# EasyEDA Pro project ProDoc_hapTGP_2025-10-23.epro

# Schematic hapTGP_SCH

## Sheets
1 P1: Board Name: Board1; Create Date: 2025-09-11; Page Name: P1; Project Name: HapTGP; Schematic Name: SCH-MB_RPI_ZERO_2W_1V1; Update Date: 2025-10-09; Company: Cégep André-Laurendeau; Page Size: A4; Version: V1.1
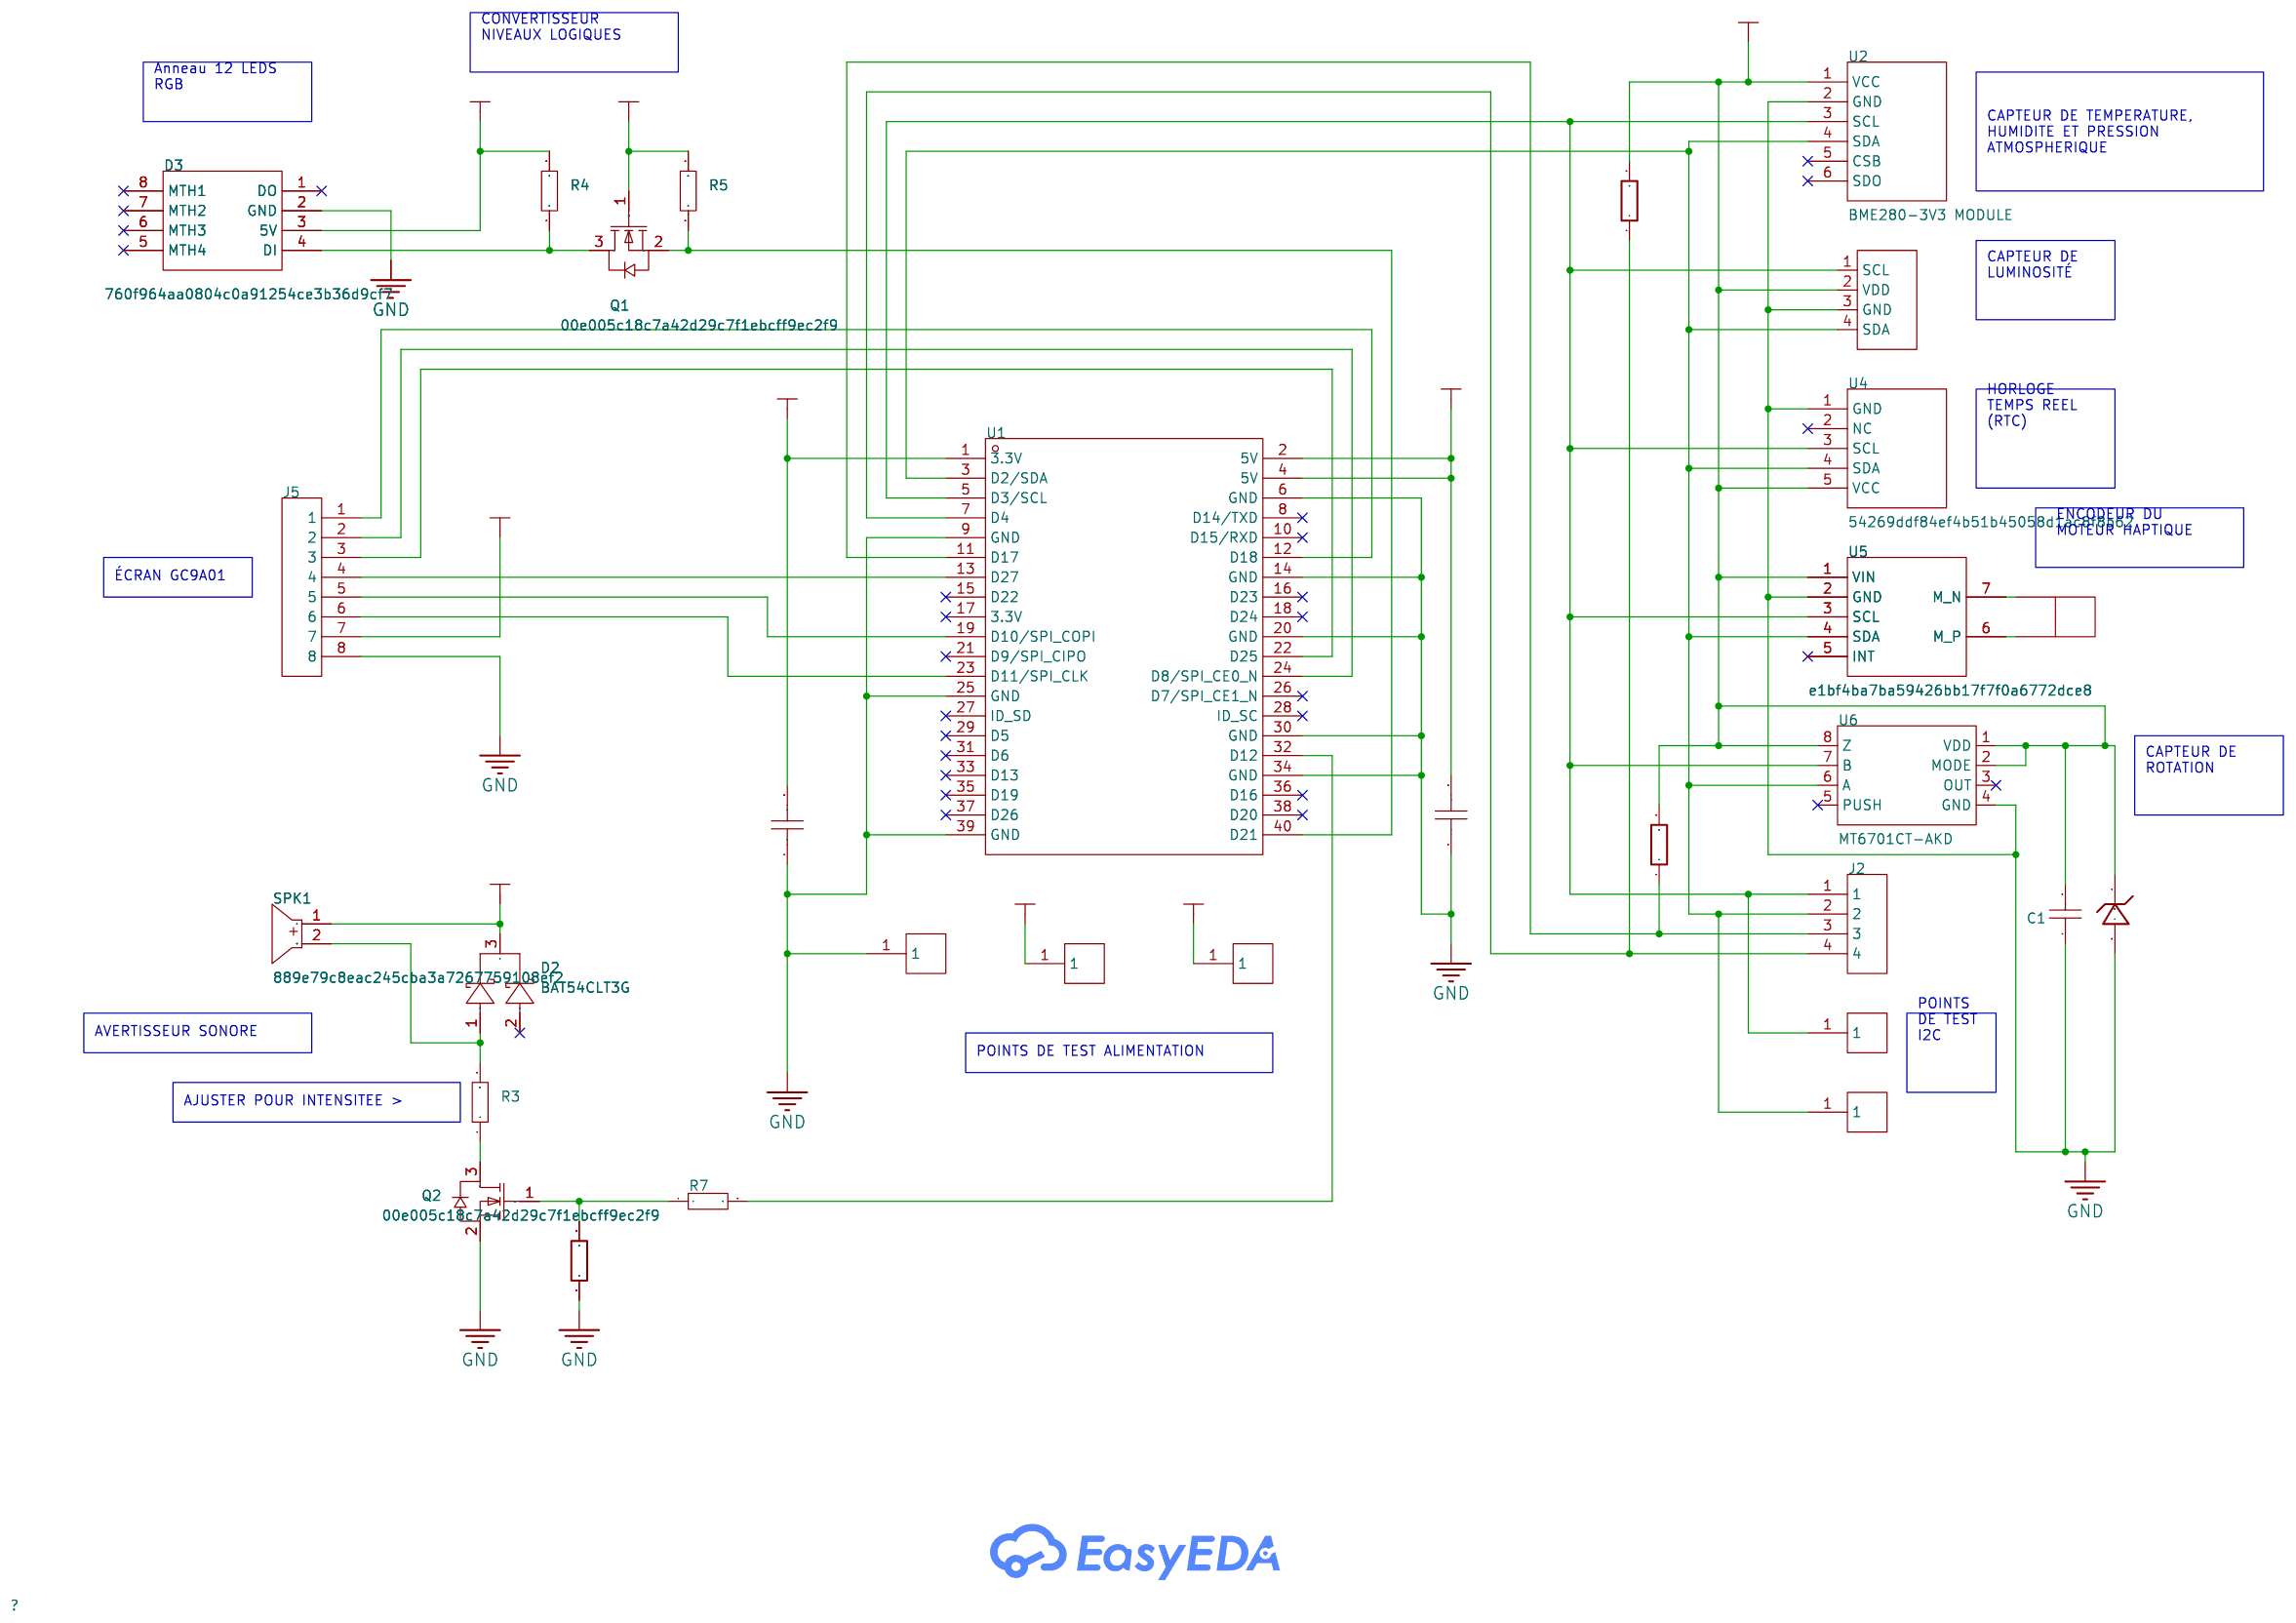
[diagram p0: P1]
2 P2: Create Date: 2025-10-02; Page Name: P2; Update Date: 2025-10-02; Company: EasyEDA.com; Version: V1.0
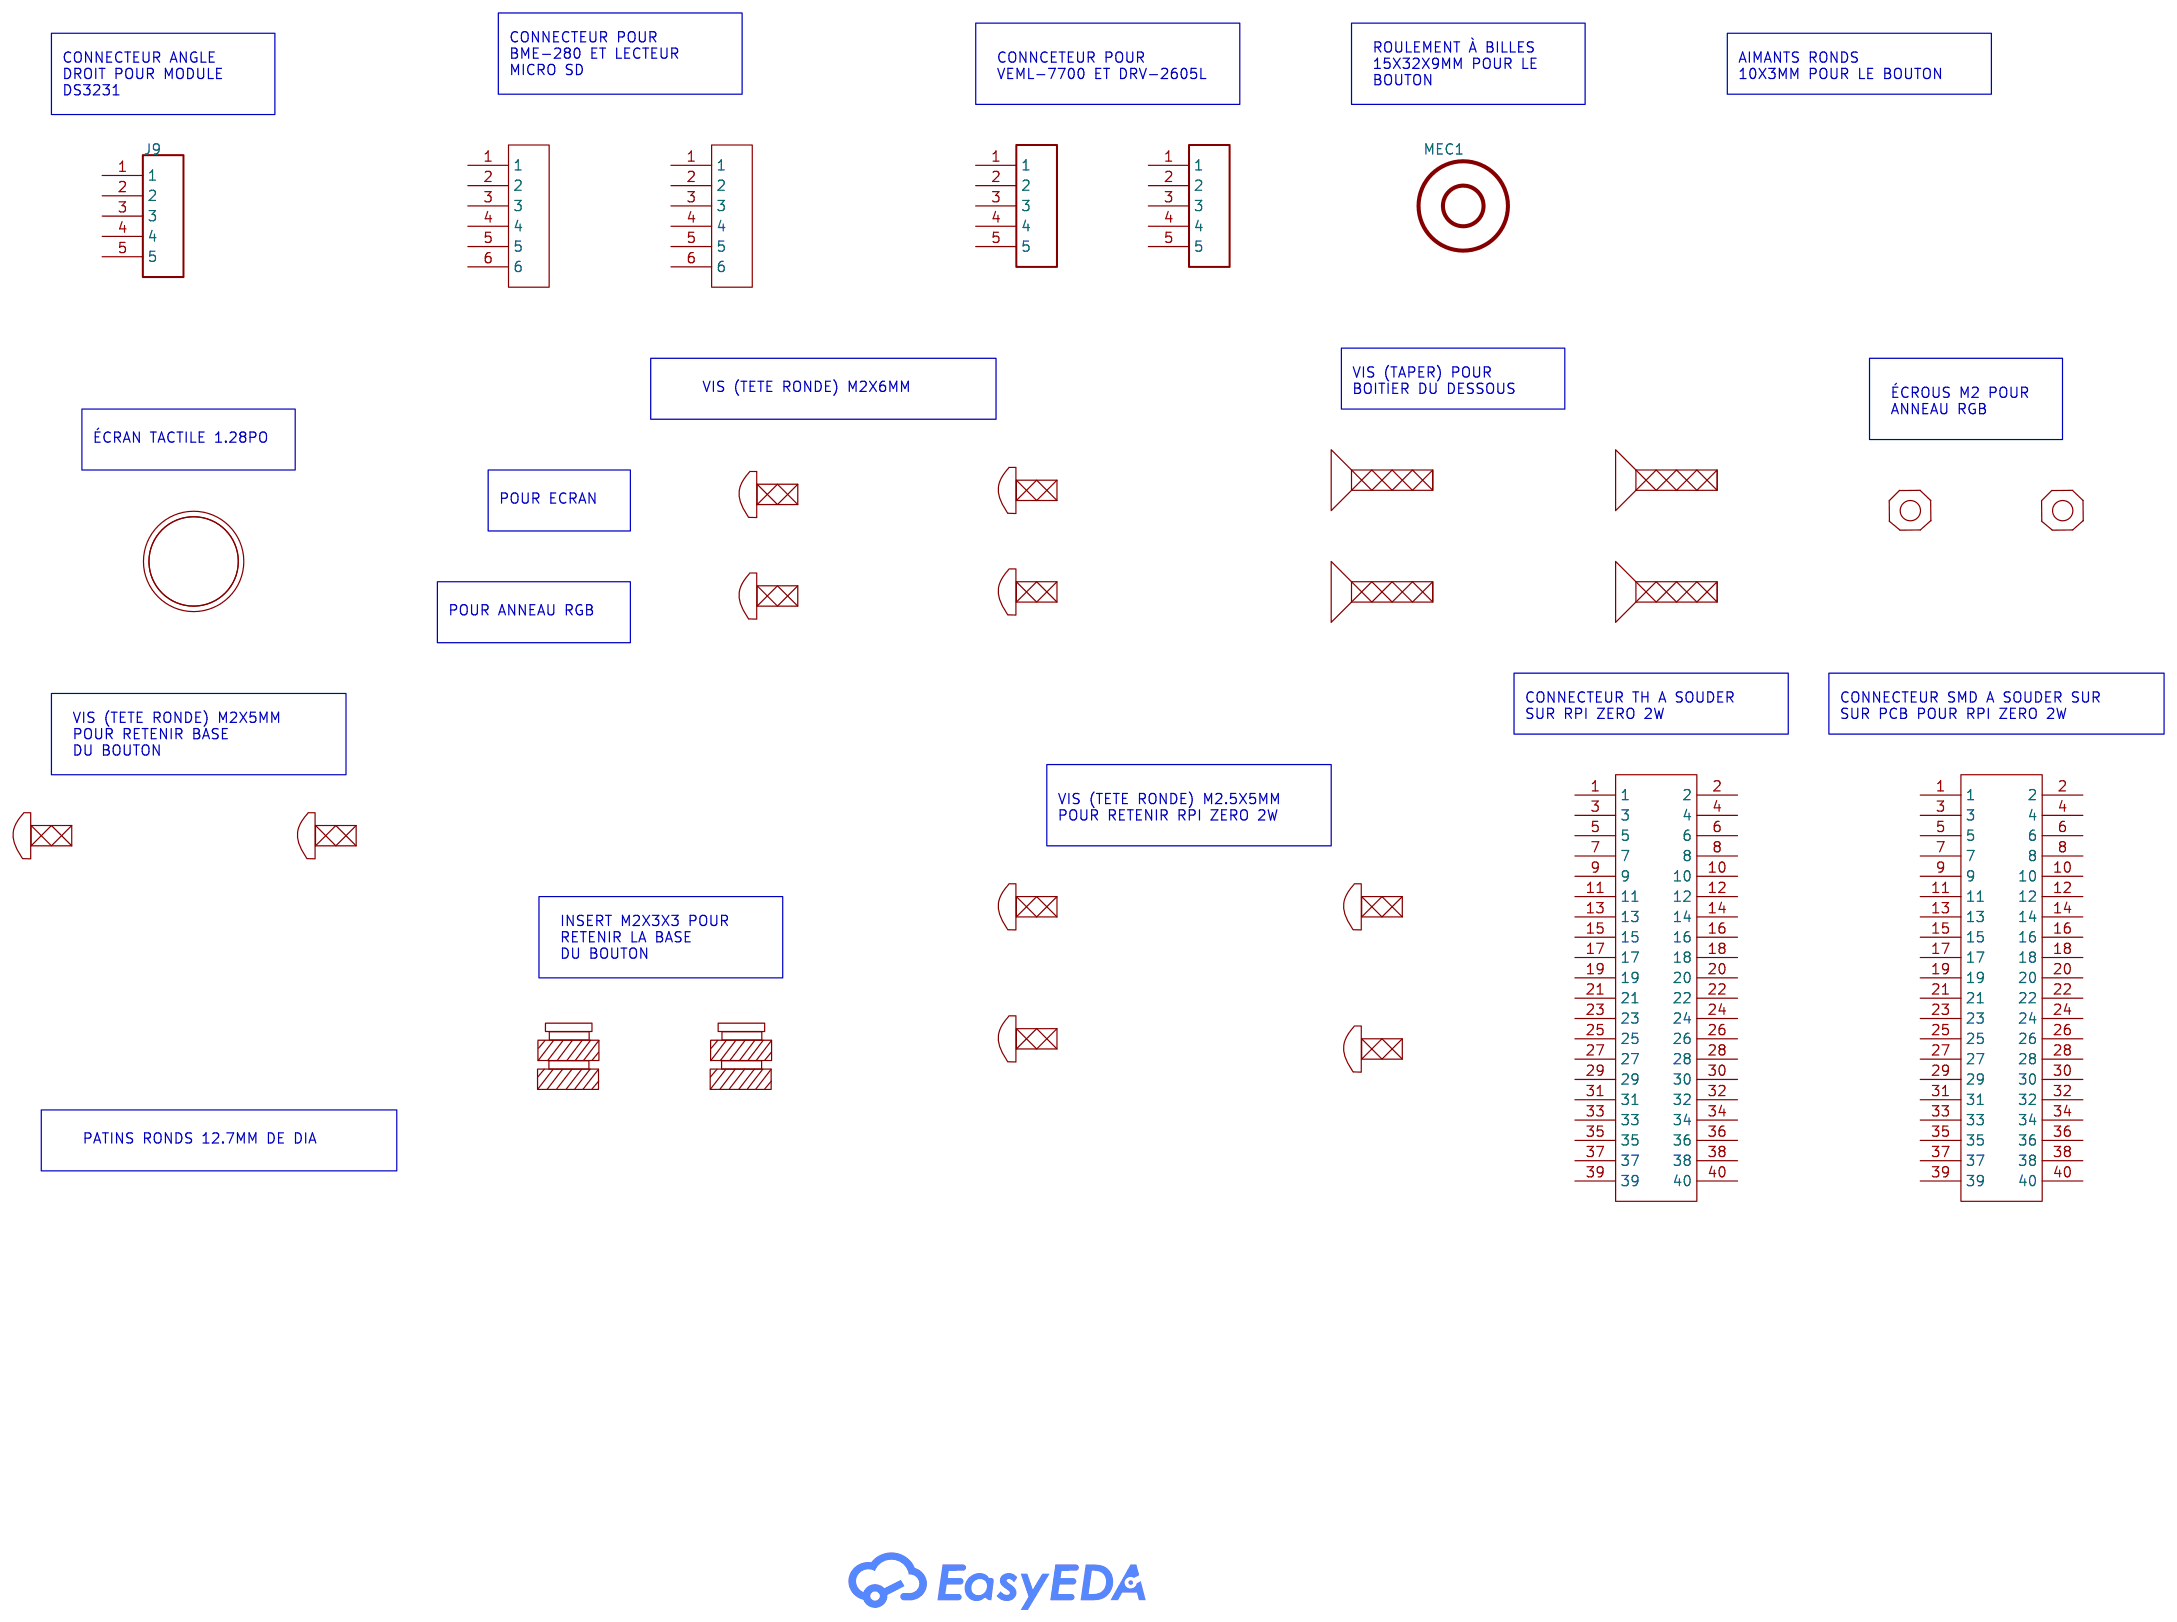
[diagram p1: P2]

## Parts
sheet P1
C1  0.1uF  [C1206]
C2  10µF  [C1206]
C3  10µF  [C1206]
D1  786c42ee781a49819dcb2175513ac30d  [SMA_L4.3-W2.6-LS5.2-RD]
D2  BAT54CLT3G  [SOT-23-3_L2.9-W1.3-P1.90-LS2.4-BR_LONG_PAD]
D3  760f964aa0804c0a91254ce3b36d9cf7  [12BIT_WS2812_RING]
J2  df3f6e4d750841a1978b57070b38a967  [TSW-104-07-G-S]
J3  25d9ce5fcc824b51a382671083746301  [TSW-101-07-G-S]
J4  25d9ce5fcc824b51a382671083746301  [TSW-101-07-G-S]
J5  db50c67101b641f09feebbd75da13b19  [TSW-108-07-G-S]
J6  25d9ce5fcc824b51a382671083746301  [TSW-101-07-G-S]
J7  25d9ce5fcc824b51a382671083746301  [TSW-101-07-G-S]
J8  25d9ce5fcc824b51a382671083746301  [TSW-101-07-G-S]
M1  a87b66f22e6449f7bc229c794d7d3cd7
Q1  00e005c18c7a42d29c7f1ebcff9ec2f9  [SOT-23-3_L2.9-W1.3-P1.90-LS2.4-BR_LONG_PAD]
Q2  00e005c18c7a42d29c7f1ebcff9ec2f9  [SOT-23-3_L2.9-W1.3-P1.90-LS2.4-BR_LONG_PAD]
R1  10kΩ  [R1206]
R3  100Ω  [R1206]
R4  1kΩ  [R1206]
R5  1kΩ  [R1206]
R6  10kΩ  [R1206]
R7  22.1Ω  [R1206]
R8  3.32kΩ  [R1206]
SPK1  2.048kHz  [CEM-1203(42)]
U1  82908ec7757f43da87b5bf82fbb97953  [RPI_ZERO_2W_SMD]
U2  BME280-3V3 MODULE  [BME280-3V3]
U4  54269ddf84ef4b51b45058d1ac8f8b62  [DS3231_FOR_PI]
U5  e1bf4ba7ba59426bb17f7f0a6772dce8  [DRV2605L_MODULE]
U6  MT6701CT-AKD  [SOIC-8_MT6701_LONG_PAD]
U7  e600161ae6e94e2281b32d82396dab58  [VEML7700-TT]
sheet P2
J9  d4bc78de218c43d6890ff5c2e1751f38  [TSW-105-08-G-S-RA]
J10  842bb1afb25c4c82b2ce2c1a00fc9b49  [TSW-106-07-G-S]
J11  842bb1afb25c4c82b2ce2c1a00fc9b49  [TSW-106-07-G-S]
J12  519a3672ea174b5fbedaf20516a41a10  [TSW-105-07-G-S]
J13  519a3672ea174b5fbedaf20516a41a10  [TSW-105-07-G-S]
J14  320c196bd822489ebe2c8557b4e2ea87  [TSW-120-07-G-D]
J15  60a980731c99412ab857ed917eeb6bae  [SSM-120-L-DV]
MEC1  4874c76d77fe4fedaef2837b43ac3319
MEC2  a5e0b033ab874c949acdb6fa7986dbbc
MEC3  a5e0b033ab874c949acdb6fa7986dbbc
MEC4  55b254a44b8a4a90b11fe05f35b53fb9
MEC5  84bc130494194e13a6b8797a8c02c4b9
MEC6  84bc130494194e13a6b8797a8c02c4b9
MEC7  84bc130494194e13a6b8797a8c02c4b9
MEC8  84bc130494194e13a6b8797a8c02c4b9
MEC9  e747b9e705f54f58a9aa79ca04ba0c74
MEC10  e747b9e705f54f58a9aa79ca04ba0c74
MEC11  e747b9e705f54f58a9aa79ca04ba0c74
MEC12  e747b9e705f54f58a9aa79ca04ba0c74
MEC13  0744fd2aaf9640809141f7db8254e100
MEC14  0744fd2aaf9640809141f7db8254e100
MEC15  44b7d81d582e44f3a2eef445dd88f108
MEC16  44b7d81d582e44f3a2eef445dd88f108
MEC17  44b7d81d582e44f3a2eef445dd88f108
MEC18  44b7d81d582e44f3a2eef445dd88f108
MEC19  fea318fc1c2846968e82746a332974ab
MEC20  fea318fc1c2846968e82746a332974ab
MEC21  b4d0d6735a904df985b20de909715984
MEC22  b4d0d6735a904df985b20de909715984
MEC23  3b06449f621e43b7b0359324f8e45c47
MEC24  3b06449f621e43b7b0359324f8e45c47
MEC25  3b06449f621e43b7b0359324f8e45c47
MEC26  3b06449f621e43b7b0359324f8e45c47

## Library data of the parts
C1 = C1206C104M5RAC7800: 0.1 µF ±20% 50V Ceramic Capacitor X7R 1206 (3216 Metric); Supplier: Digikey; Manufacturer: KEMET; Supplier Part: 399-C1206C104M5RACTUCT-ND; URL: https://www.digikey.ca/en/products/detail/kemet/C1206C104M5RAC7800/411247
C2 C3 = CL31B106MOHNNNE: 10 µF ±20% 16V Ceramic Capacitor X7R 1206 (3216 Metric); Supplier Part: 1276-6641-1-ND; Manufacturer: Samsung Electro-Mechanics; Supplier: Digikey; URL: https://www.digikey.ca/en/products/detail/samsung-electro-mechanics/CL31B106MOHNNNE/5961125?s=N4IgTCBcDaIMIBkDMBGAQigDANgLIHkAJAOVIFEQBdAXyA
D1 = SMAJ6.0A: 10.3V Clamp 38.8A Ipp Tvs Diode Surface Mount DO-214AC (SMA); Supplier: Digikey; Manufacturer: Littelfuse Inc.; Supplier Part: SMAJ6.0ALFCT-ND; URL: https://www.digikey.ca/en/products/detail/littelfuse-inc/SMAJ6-0A/762252
D2 = BAT54C/SOT23: Diode Array 1 Pair Common Cathode 30 V 200mA (DC) Surface Mount TO-236-3, SC-59, SOT-23-3; Supplier Part: BAT54CLT3GOSCT-ND; Manufacturer: onsemi; Supplier: Digikey; URL: https://www.digikey.ca/en/products/detail/onsemi/BAT54CLT3G/1792157?s=N4IgTCBcDaIEIEEAqBWALAYQDJIMwHEB5AZQyQFoA5AERAF0BfIA
D3 = 12BIT_WS2812_RING: 12 Bit WS2812 Neopixel Ring; Manufacturer: WAVGAT Official Store; Manufacturer Part: Color: 12 Bit; Supplier: Aliexpress; Supplier Part: Color: 12 Bit; URL: https://www.aliexpress.com/item/32758176722.html?spm=a2g0o.order_list.order_list_main.9.3dfb1802yhWrDt
J2 = TSW-104-07-G-S: Connector Header Through Hole 4 position 0.100" (2.54mm); Manufacturer: Samtec; Supplier: Digikey; Supplier Part: SAM1029-04-ND; URL: https://www.digikey.ca/en/products/detail/samtec-inc/TSW-104-07-G-S/1101323
J3 J4 J6-J8 = TSW-101-07-G-S: Connector Header Through Hole 1 position; Manufacturer: Samtec; Supplier: Digikey; Supplier Part: SAM1029-01-ND; URL: https://www.digikey.ca/en/products/detail/samtec-inc/TSW-101-07-G-S/1101326
J5 = TSW-108-07-G-S: Connector Header Through Hole 8 position 0.100" (2.54mm); Manufacturer: Samtec; Supplier: Digikey; Supplier Part: SAM1029-08-ND; URL: https://www.digikey.ca/en/products/detail/samtec-inc/TSW-108-07-G-S/1101319
M1 = HAPTIC_MOTOR_10X2MM: DC Motor Vibration, ERM (Haptic) 3VDC; URL: https://www.digikey.ca/en/products/detail/seeed-technology-co-ltd/316040001/5487672?s=N4IgTCBcDaIIwFYCcB2AtHMAWLaByAIiALoC%2BQA; Manufacturer: Seeed Technology Co., Ltd; Manufacturer Part: 316040001; Supplier: Digikey; Supplier Part: 1597-1244-ND
Q1 Q2 = BSS138: N-Channel 50 V 170mA 350mW (Ta) Surface Mount SOT-23-3; Supplier: Digikey; Manufacturer: OnSemi; Supplier Part: BSS138CT-ND; URL: https://www.digikey.ca/en/products/detail/onsemi/BSS138/244210
R1 R6 = RMCF1206FT10K0: 10 kOhms ±1% 0.25W, 1/4W Chip Resistor 1206 (3216 Metric) Automotive AEC-Q200 Thick Film; Supplier: Digikey; Supplier Part: RMCF1206FT10K0CT-ND; Manufacturer: Stackpole Electronics Inc; URL: https://www.digikey.ca/en/products/detail/stackpole-electronics-inc/RMCF1206FT10K0/1759669?s=N4IgTCBcDaIEoFkDCAxAjGADANhQFTUwGlMQBdAXyA
R3 = RMCF1206FG100R: 100 Ohms ±1% 0.25W, 1/4W Chip Resistor 1206 (3216 Metric) Automotive AEC-Q200 Thick Film; Supplier: Digikey; Supplier Part: RMCF1206FG100RCT-ND; Manufacturer: Stackpole Electronics Inc; URL: https://www.digikey.ca/en/products/detail/stackpole-electronics-inc/RMCF1206FG100R/1759135?s=N4IgTCBcDaIEoFkDCAxAjGADANhQcTU0zhAF0BfIA
R4 R5 = RNCP1206FTD1K00: 1 kOhms ±1% 0.5W, 1/2W Chip Resistor 1206 (3216 Metric) Anti-Sulfur Thin Film; Supplier: Digikey; Supplier Part: RNCP1206FTD1K00CT-ND; Manufacturer: Stackpole Electronics Inc; URL: https://www.digikey.ca/en/products/detail/stackpole-electronics-inc/RNCP1206FTD1K00/2240337
R7 = RNCP1206FTD22R1: 22.1 Ohms ±1% 0.5W, 1/2W Chip Resistor 1206 (3216 Metric) Anti-Sulfur Thin Film; Supplier: Digikey; Supplier Part: RNCP1206FTD22R1CT-ND; Manufacturer: Stackpole Electronics Inc; URL: https://www.digikey.ca/en/products/detail/stackpole-electronics-inc/RNCP1206FTD22R1/2240307
R8 = RMCF1206FT3K32: 3.32 kOhms ±1% 0.25W, 1/4W Chip Resistor 1206 (3216 Metric) Automotive AEC-Q200 Thick Film; Supplier: Digikey; Manufacturer: Stackpole Electronics Inc; URL: https://www.digikey.ca/en/products/detail/stackpole-electronics-inc/RMCF1206FT3K32/1753915
SPK1 = CEM-1203(42): Driver Circuitry:Passive (external drive) Technology:Electromagnetic Type Voltage - Supply:3V~5V Voltage - Supply:3V~5V Frequency:2.048kHz Sound Pressure Level(SPL):85dB Diameter(φD):12mm Height:9mm Operating Temperature:-20℃~+60℃ Operating Temperature:-2; Supplier Part: 102-1153-ND; Manufacturer: CUI; Supplier: Digikey; URL: https://www.digikey.ca/en/products/detail/same-sky-formerly-cui-devices/CEM-1203-42/412412
U1 = RPI_ZERO_2W_SMD: Raspberry Pi Zero 2 W SC1176 single board computer.,1GHz quad-core Broadcom BCM2710A1 Arm Cortex-A53 processor, 512MB of RAM, 40 digital I/O lines, Bluetooth 4.2, BLE, HAT GPIO and LAN.; Supplier Part: 2648-SC1176-ND; Manufacturer: Raspberry Pi; Manufacturer Part: SC1176; Supplier: Digikey; URL: https://www.digikey.ca/en/products/detail/raspberry-pi/SC1176/15298147
U2 = BME280-3V3 MODULE: Humidity, Pressure, Temperature 0 ~ 100% RH I2C, SPI ±3% 1 s Surface Mount; Manufacturer: Simple Robot Store; Manufacturer Part: GY-BME280-3.3V; Supplier Part: GY-BME280-3.3V; Supplier: Aliexpress; URL: https://www.aliexpress.com/item/1005002963592665.html?spm=a2g0o.order_list.order_list_main.4.32a61802cuksvp
U4 = DS3231_FOR_PI: Real Time Clock (RTC) IC Clock/Calendar I2C, 2-Wire Serial; Supplier Part: DS3231; Supplier: Aliexpress; Manufacturer: Simple Robot Store; Manufacturer Part: DS3231; URL: https://www.aliexpress.com/item/1812869576.html?spm=a2g0o.order_list.order_list_main.152.32a61802cuksvp
U5 = DRV2605L_MODULE: Adafruit DRV2605L Haptic Motor Controller; Manufacturer: Simple Robot Store; Manufacturer Part: Color: Driving module; Supplier: Aliexpress; URL: https://www.aliexpress.com/item/1005006900947978.html?spm=a2g0o.order_list.order_list_main.14.679a1802Tgud2h; Supplier Part: Color: Driving module
U6 = MT6701CT-AKD: Hall Based Angle Position Encoder Sensor; Supplier: Aliexpress; Supplier Part: SOP8-IIC Default; Manufacturer: Red Yellow Store; Manufacturer Part: SOP8-IIC Default; URL: https://www.aliexpress.com/item/1005008024064935.html?spm=a2g0o.order_list.order_list_main.4.3da51802w8S4od
U7 = VEML7700-TT: Optical Sensor Ambient I2C 4-SMD, J-Lead - Top View; Supplier Part: 751-VEML7700-TTCT-ND; Manufacturer: Vishay; Supplier: Digikey; URL: https://www.digikey.ca/en/products/detail/vishay-semiconductor-opto-division/VEML7700-TT/6210690
J9 = TSW-105-08-G-S-RA: Connector Header Through Hole, Right Angle 5 position 0.100" (2.54mm); Manufacturer: Samtec; Supplier: Digikey; Supplier Part: SAM1039-05-ND; URL: https://www.digikey.ca/en/products/detail/samtec-inc/TSW-105-08-G-S-RA/1101819
J10 J11 = TSW-106-07-G-S: Connector Header Through Hole 6 position 0.100" (2.54mm); Manufacturer: Samtec; Supplier: Digikey; Supplier Part: SAM1029-06-ND; URL: https://www.digikey.ca/en/products/detail/samtec-inc/TSW-106-07-G-S/1101321
J12 J13 = TSW-105-07-G-S: Connector Header Through Hole 5 position 0.100" (2.54mm); Manufacturer: Samtec; Supplier: Digikey; Supplier Part: SAM1029-05-ND; URL: https://www.digikey.ca/en/products/detail/samtec-inc/TSW-105-07-G-S/1101322
J14 = TSW-120-07-G-D: Connector Header Through Hole 40 position 0.100" (2.54mm); URL: https://www.digikey.ca/en/products/detail/samtec-inc/TSW-120-07-G-D/1101257; Manufacturer: Samtec; Supplier: Digikey; Supplier Part: SAM1028-20-ND
J15 = SSM-120-L-DV: 40 Position Receptacle, Pass Through Connector 0.100" (2.54mm) Surface Mount Gold; URL: https://www.digikey.ca/en/products/detail/samtec-inc/SSM-120-L-DV/1106211; Manufacturer: Samtec; Supplier: Digikey; Supplier Part: SAM1146-20-ND
MEC1 = BEARING_15x32x9MM: 6002-2RS 15x32x9mm Precision Chrome Steel Bearings Double Rubber Sealed Seal Bearings 10Pcs for RC Car / UAV / Bicycles; URL: https://aliexpi.com/Iuda; Supplier: Aliexpress; Manufacturer: Bearing World Store; Manufacturer Part: 6002-2RS; Supplier Part: 6002-2RS
MEC2 MEC3 = MAGNET_10X3MM_ROUND: 10x3mm tiny round disc small, refrigerator neodymium 20/50/100pcs, Muti-use premium neodymium fridge rare earth, whiteboard; URL: https://aliexpi.com/sLDT; Manufacturer: Magical Magnet Life Store; Manufacturer Part: Color: 10x3mm-10PCS; Supplier: Aliexpress; Supplier Part: Color: 10x3mm-10PCS
MEC4 = 1.28IN_TFT_TOUCH_SCREEN: 1.28 inch TFT Screen Display Module 1.28" IPS Round Colorful LCD Board GC9A01 Touch 240x240 SPI; URL: https://aliexpi.com/IKIM; Manufacturer: Your Cee; Manufacturer Part: Color: Module With Touch; Supplier: Aliexpress; Supplier Part: Color: Module With Touch
MEC5-MEC8 = M2x6_ROUND_HEAD_SCREW: M2 Stainless steel iron plating round head, Phillips screw bolt length 6mm; URL: https://aliexpi.com/RNjy; Manufacturer: Darzoom Store; Manufacturer Part: Size: M2, Length: 6mm; Supplier: Aliexpress; Supplier Part: Size: M2, Length: 6mm
MEC9-MEC12 = M3x20_FLAT_HEAD_SCREW: M3x20mm Flat Head Machine Screws; URL: https://www.amazon.ca/dp/B07VK3Y6WK?ref=ppx_yo2ov_dt_b_fed_asin_title&th=1; Supplier: Amazon.ca; Supplier Part: M3x20mm; Manufacturer: UXCELL; Manufacturer Part: M3x20mm
MEC13 MEC14 = M2x5_ROUND_HEAD_SCREW: M2 Stainless steel iron plating round head, Phillips screw bolt length 5mm; URL: https://aliexpi.com/Fjtn; Manufacturer: Darzoom Store; Manufacturer Part: Size: M2, Length: 5mm; Supplier: Aliexpress; Supplier Part: Size: M2, Length: 5mm
MEC15-MEC18 = M2.5x5_ROUND_HEAD_SCREW: M2.5 Stainless steel iron plating round head, Phillips screw bolt length 5mm; URL: https://aliexpi.com/Fjtn; Manufacturer: Darzoom Store; Manufacturer Part: Size: M2.5, Length: 5mm; Supplier: Aliexpress; Supplier Part: Size: M2.5, Length: 5mm
MEC19 MEC20 = M2_HEX_NUT: Stainless steel iron Hex Hexagon Nut for M2 Srew Bolt; URL: https://aliexpi.com/RLok; Manufacturer: Darzoom Store; Manufacturer Part: Size: M2 ( 50 pcs); Supplier: Aliexpress; Supplier Part: Size: M2 ( 50 pcs)
MEC21 MEC22 = INSERT_M2X3X3: M2 Heat Set Insert for 3D Printing Components and Plastic Parts - Brass Metric Knurled Nuts; URL: https://www.amazon.ca/-/fr/HANGLIFE-thermodurcissables-composants-dimpression-plastique/dp/B0CS6XJSSL/?th=1; Manufacturer: Hanglife; Manufacturer Part: Colour Name: M2 X D3 X L3(100pcs); Supplier: Amazon; Supplier Part: Colour Name: M2 X D3 X L3(100pcs)
MEC23-MEC26 = ClearRubberBumper_12.7MM: Round 12.7mm Cabinet Bumpers Soft Self-Adhesive Clear Rubber Bumper; Manufacturer: Furnigear; Manufacturer Part: Size: Cylindrical 96pcs; Supplier: Amazon.ca; Supplier Part: Size: Cylindrical 96pcs; URL: https://www.amazon.ca/dp/B0BZBXY984?ref=ppx_yo2ov_dt_b_product_details&th=1

## Nets
3V3: C1.2 C3.2 D1.1(C) D2.3(K) J5.7 J8.1 Q1.1(G) R1.2 R5.2 R8.2 SPK1.1 U1.1(3.3V) U2.1(VCC) U4.5(VCC) U5.1(VIN) U6.1(VDD) U6.2(MODE) U6.8(Z) U7.2(VDD)
5V0: C2.2 D3.3(5V) J7.1 R4.2 U1.2(5V) U1.4(5V)
GND: C1.1 C2.1 C3.1 D1.2(A) D3.2(GND) J5.8 J6.1 Q2.2(S) R6.1 U1.6(GND) U1.9(GND) U1.14(GND) U1.20(GND) U1.25(GND) U1.30(GND) U1.34(GND) U1.39(GND) U2.2(GND) U4.1(GND) U5.2(GND) U6.4(GND) U7.3(GND)
$1N1876: J2.4 R1.1 U1.7(D4)
$1N2735: J2.2 J4.1 U1.3(D2/SDA) U2.4(SDA) U4.4(SDA) U5.4(SDA) U6.6(A) U7.4(SDA)
$1N2755: J2.1 J3.1 U1.5(D3/SCL) U2.3(SCL) U4.3(SCL) U5.3(SCL) U6.7(B) U7.1(SCL)
$1N3138: J5.4 U1.13(D27)
$1N3152: J5.5 U1.19(D10/SPI_COPI)
$1N3158: J5.6 U1.23(D11/SPI_CLK)
$1N3184: J5.1 U1.12(D18)
$1N3198: J5.2 U1.24(D8/SPI_CE0_N)
$1N3220: J5.3 U1.22(D25)
$1N3578: D2.1(A) R3.2 SPK1.2
$1N4140: Q1.2(S) R5.1 U1.40(D21)
$1N4146: D3.4(DI) Q1.3(D) R4.1
$1N4451: Q2.3(D) R3.1
$1N4603: R7.2 U1.32(D12)
$1N4609: Q2.1(G) R6.2 R7.1
$1N5451: J2.3 R8.1 U1.11(D17)

Not connected (* = marked no-connect by the designer): D2 2(A)*; D3 1(DO)* 5(MTH4)* 6(MTH3)* 7(MTH2)* 8(MTH1)*; J9 1 2 3 4 5; J10 1 2 3 4 5 6; J11 1 2 3 4 5 6; J12 1 2 3 4 5; J13 1 2 3 4 5; J14 1 2 3 4 5 6 7 8 9 10 11 12 13 14 15 16 17 18 19 20 21 22 23 24 25 26 27 28 29 30 31 32 33 34 35 36 37 38 39 40; J15 1 2 3 4 5 6 7 8 9 10 11 12 13 14 15 16 17 18 19 20 21 22 23 24 25 26 27 28 29 30 31 32 33 34 35 36 37 38 39 40; U1 8(D14/TXD)* 10(D15/RXD)* 15(D22)* 16(D23)* 17(3.3V)* 18(D24)* 21(D9/SPI_CIPO)* 26(D7/SPI_CE1_N)* 27(ID_SD)* 28(ID_SC)* 29(D5)* 31(D6)* 33(D13)* 35(D19)* 36(D16)* 37(D26)* 38(D20)*; U2 5(CSB)* 6(SDO)*; U4 2(NC)*; U5 5(INT)* 6(M_P) 7(M_N); U6 3(OUT)* 5(PUSH)*

## Notes on the sheets
sheet 1
- CONVERTISSEUR
  NIVEAUX LOGIQUES
- Anneau 12 LEDS
  RGB
- CAPTEUR DE TEMPERATURE,
  HUMIDITE ET PRESSION
  ATMOSPHERIQUE
- CAPTEUR DE
  LUMINOSITÉ
- HORLOGE
  TEMPS REEL
  (RTC)
- ENCODEUR DU
  MOTEUR HAPTIQUE
- ÉCRAN GC9A01
- CAPTEUR DE
  ROTATION
- AVERTISSEUR SONORE
- POINTS DE TEST ALIMENTATION
- POINTS
  DE TEST
  I2C
- AJUSTER POUR INTENSITEE ­­>
sheet 2
- CONNECTEUR POUR
  BME-280 ET LECTEUR
  MICRO SD
- ROULEMENT À BILLES
  15X32X9MM POUR LE
  BOUTON
- CONNECTEUR ANGLE
  DROIT POUR MODULE
  DS3231
- CONNCETEUR POUR
  VEML-7700 ET DRV-2605L
- AIMANTS RONDS
  10X3MM POUR LE BOUTON
- VIS (TAPER) POUR
  BOITIER DU DESSOUS
- VIS (TETE RONDE) M2X6MM
- ÉCROUS M2 POUR
  ANNEAU RGB
- ÉCRAN TACTILE 1.28PO
- POUR ECRAN
- POUR ANNEAU RGB
- CONNECTEUR TH A SOUDER
  SUR RPI ZERO 2W
- CONNECTEUR SMD A SOUDER SUR
  SUR PCB POUR RPI ZERO 2W
- VIS (TETE RONDE) M2X5MM
  POUR RETENIR BASE
  DU BOUTON
- VIS (TETE RONDE) M2.5X5MM
  POUR RETENIR RPI ZERO 2W
- INSERT M2X3X3 POUR
  RETENIR LA BASE
  DU BOUTON
- PATINS RONDS 12.7MM DE DIA

# Board hapTGP_PCB
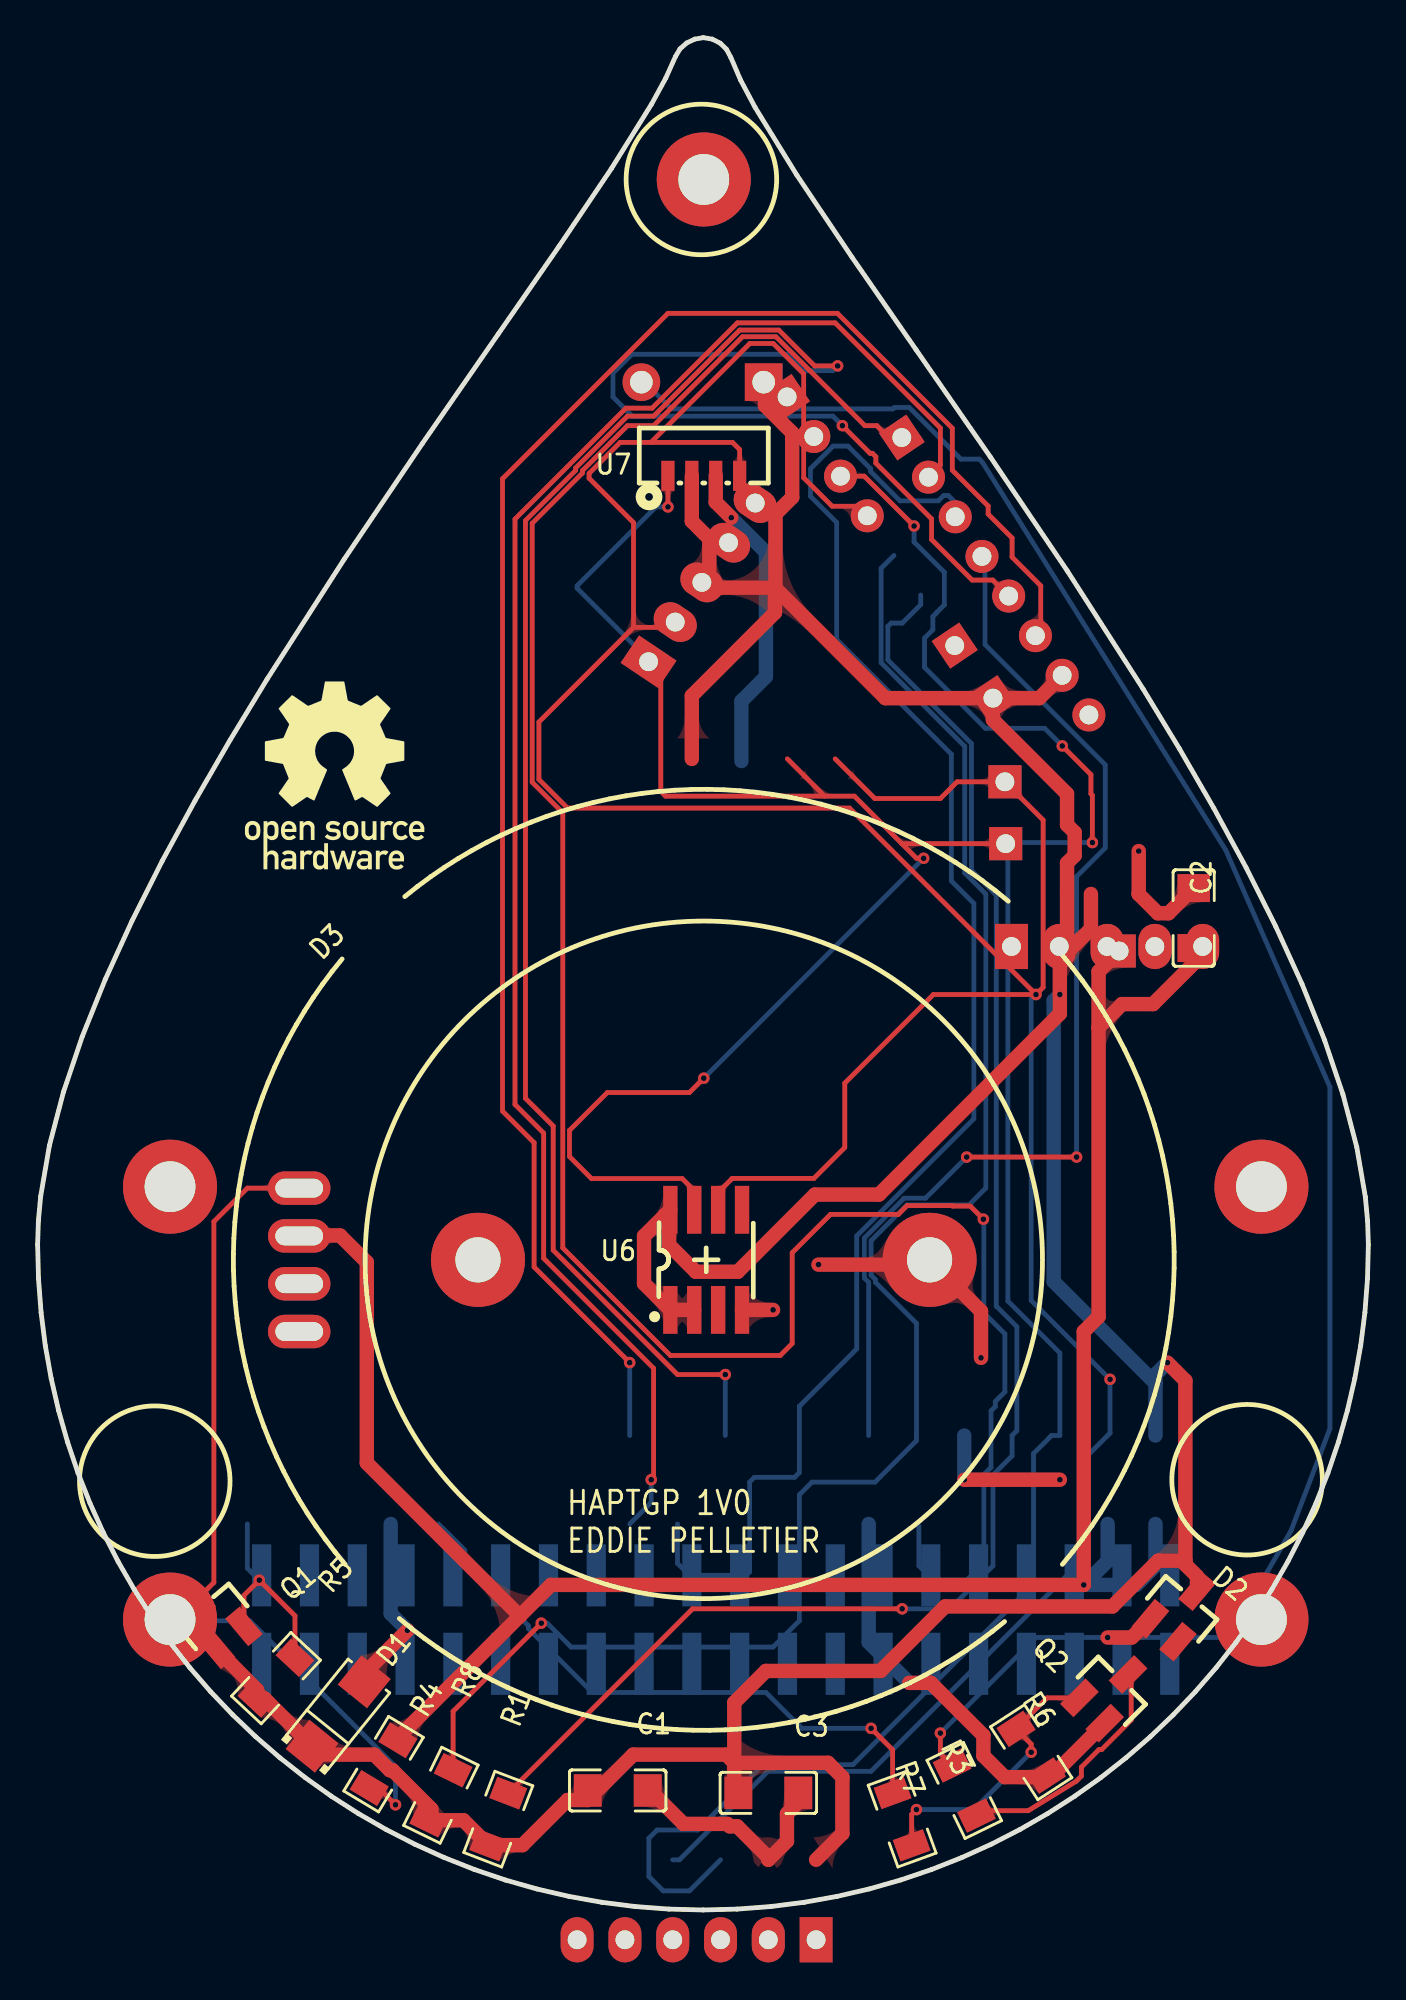
[diagram p2: board, top side]
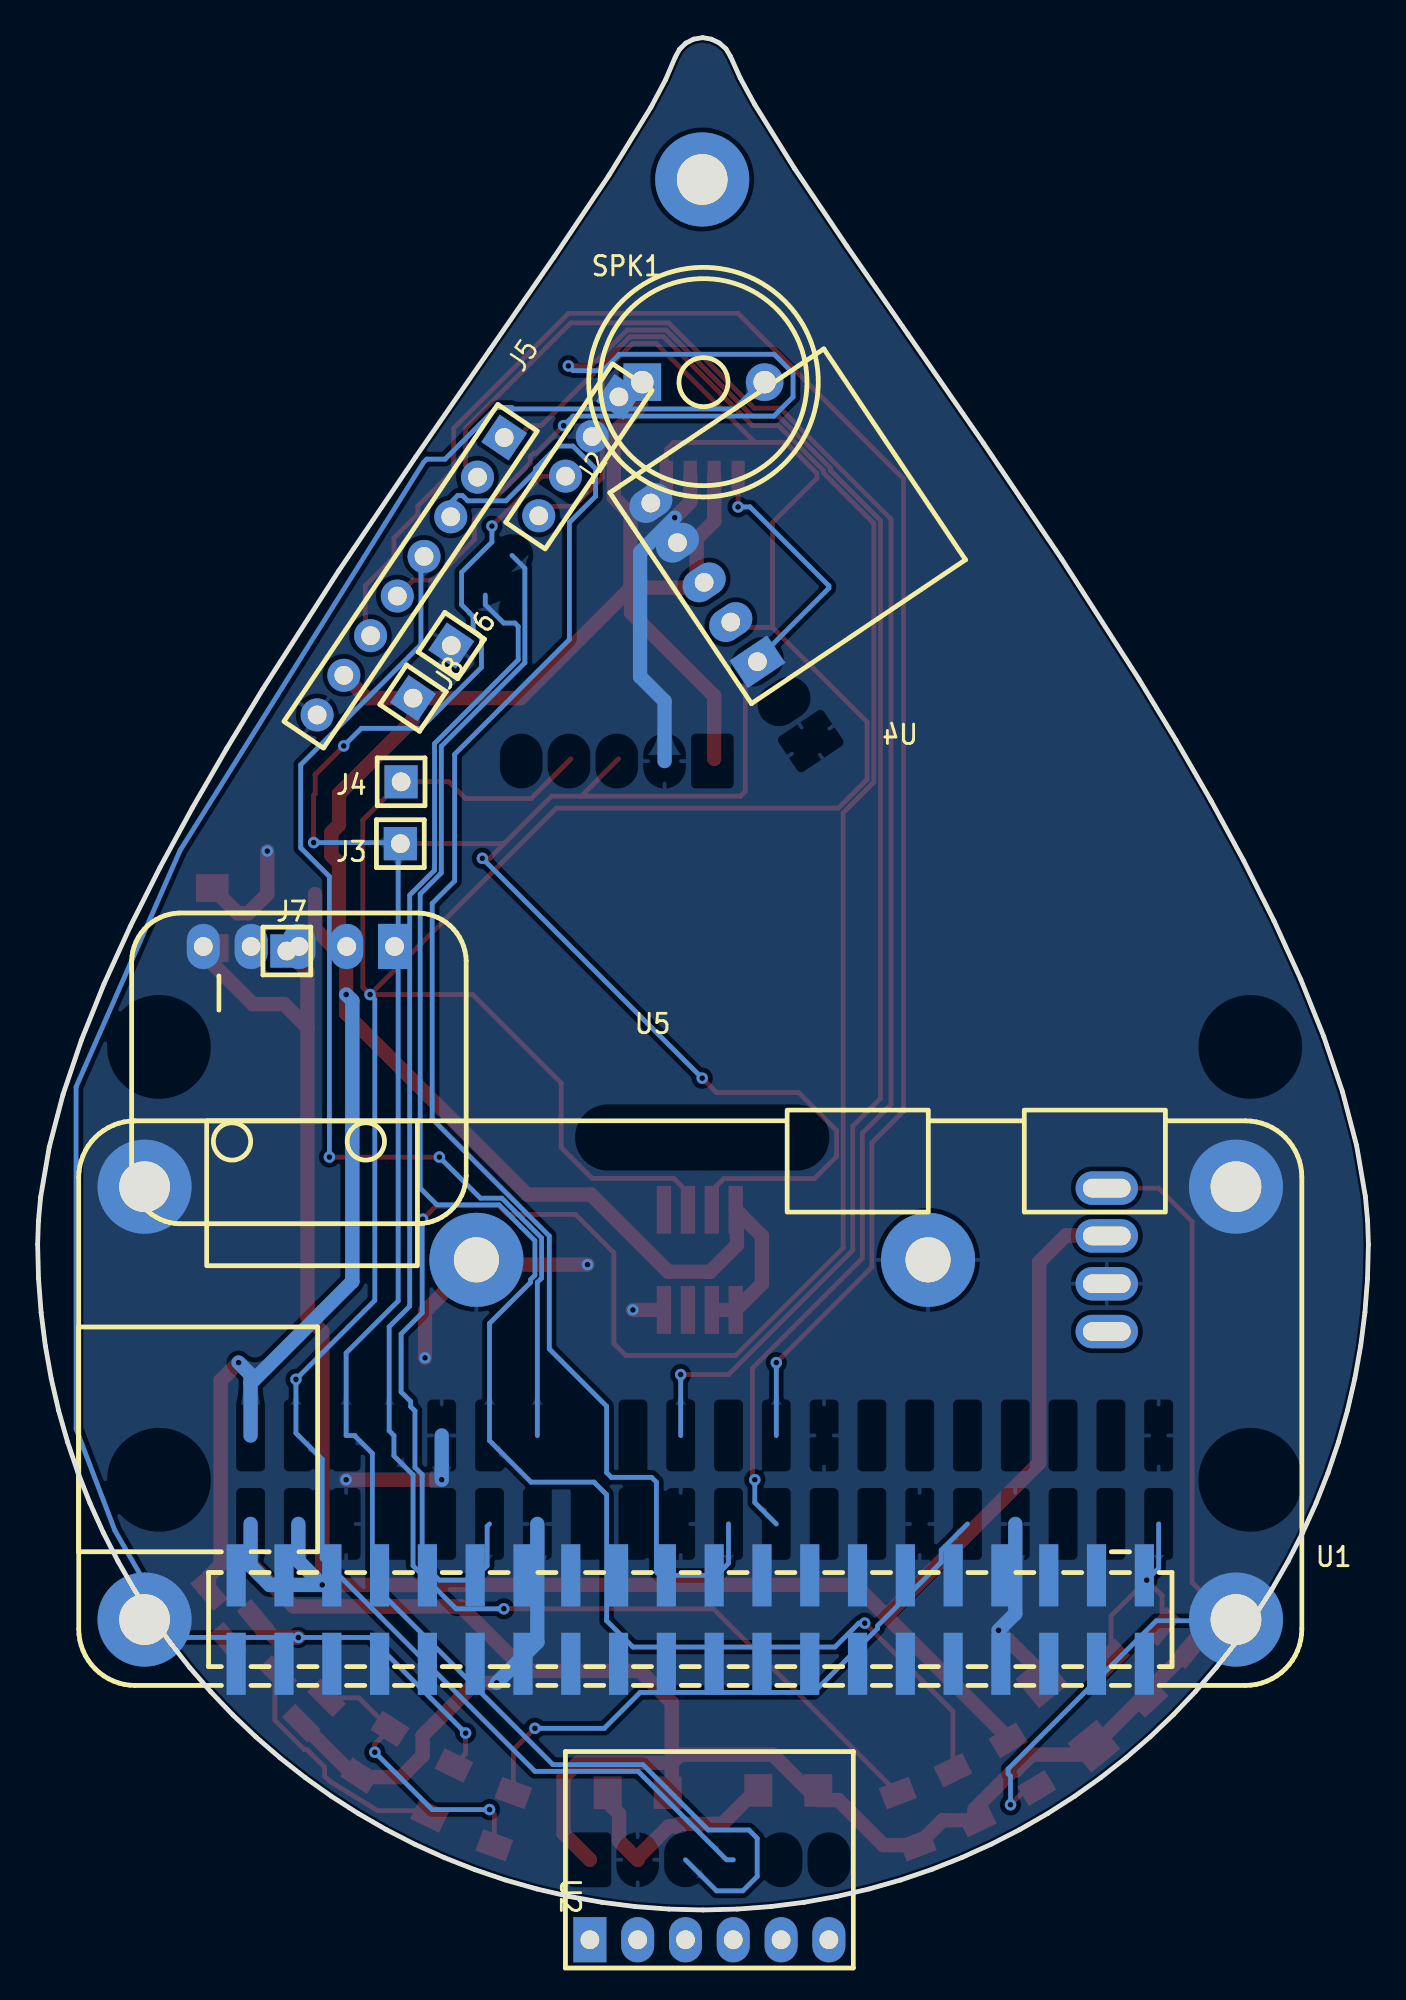
[diagram p3: board, bottom side, seen from below]

Outline 70.72 x 99.48 mm; copper layers: Top Layer, Bottom Layer. Coordinates in mm from the lower left corner of the outline.
Outline path: 0,35.36 0.05,33.54 0.18,31.75 0.41,29.98 0.72,28.24 1.11,26.53 1.59,24.86 2.15,23.22 2.78,21.61 3.49,20.04 4.27,18.52 5.13,17.04 6.05,15.6 7.03,14.22 8.08,12.88 9.2,11.6 10.37,10.37 11.6,9.2 12.88,8.09 14.22,7.03 15.6,6.05 17.04,5.13 18.52,4.27 20.04,3.49 21.61,2.78 23.21,2.15 24.86,1.59 26.53,1.12 28.24,0.72 29.98,0.41 31.75,0.18 33.54,0.05 35.36,0 37.18,0.05 38.97,0.18 40.74,0.41 42.48,0.72 44.19,1.12 45.86,1.59 47.5,2.15 49.11,2.78 50.68,3.49 52.2,4.27 53.68,5.13 55.12,6.05 56.5,7.03 57.84,8.09 59.12,9.2 60.35,10.37 61.52,11.6 62.63,12.88 63.69,14.22 64.67,15.6 65.59,17.04 66.44,18.52 67.23,20.04 67.94,21.61 68.57,23.22 69.13,24.86 69.6,26.53 70,28.24 70.31,29.98 70.54,31.75 70.67,33.54 70.72,35.36 70.68,36.6 70.56,37.88 70.1,40.54 69.37,43.33 68.39,46.23 67.19,49.21 65.79,52.27 64.22,55.39 62.5,58.54 60.67,61.71 58.75,64.88 54.72,71.15 50.63,77.21 46.68,82.9 43.28,87.81 40.35,92.17 38.13,95.78 37.35,97.24 36.84,98.44 36.61,98.86 36.27,99.19 35.85,99.4 35.38,99.48 34.92,99.4 34.49,99.2 34.14,98.89 33.89,98.47 33.38,97.34 32.63,95.96 30.5,92.53 27.71,88.39 24.48,83.73 20.46,77.94 16.29,71.77 12.19,65.39 10.23,62.17 8.36,58.94 6.62,55.73 5.02,52.56 3.6,49.45 2.37,46.41 1.37,43.46 0.63,40.63 0.16,37.92 0.04,36.62 0,35.36
Stack: Top Layer 0.035mm / Dielectric1 1.51mm FR4 er 4.5 / Bottom Layer 0.035mm

## Design rules (mm)
template: Custom Config
spacing copperThickness1oz (default): track to track 0.102, other pairs 0.127 to 0.381
spacing copperThickness2oz: track to track 0.203, other pairs 0.152 to 0.3
track width copperThickness1oz (default): min 0.127, default 0.254, max 2.54
track width copperThickness2oz: min 0.203, default 0.254, max 2.54
differential pair differentialPair (default): width min 0.127, default 0.254, max 2.54; gap min 0.152, default 0.152
via viaSize (default): diameter min 0.5, default 0.61, max 10; hole min 0.3, default 0.305, max 6.3

## Placement (name value [footprint] x y rotation side)
C1  0.1uF  [C1206]  30.83 6.35 180 top
C2  10µF  [C1206]  61.44 52.71 270 top
C3  10µF  [C1206]  38.83 6.22 180 top
D1  786c42ee781a49819dcb2175513ac30d  [SMA_L4.3-W2.6-LS5.2-RD]  15.97 10.41 51 top
D2  BAT54CLT3G  [SOT-23-3_L2.9-W1.3-P1.90-LS2.4-BR_LONG_PAD]  60.74 15.9 320 top
D3  760f964aa0804c0a91254ce3b36d9cf7  [12BIT_WS2812_RING]  35.4 34.54 45 top
J2  df3f6e4d750841a1978b57070b38a967  [TSW-104-07-G-S]  44.8 73.03 304 bottom
J3  25d9ce5fcc824b51a382671083746301  [TSW-101-07-G-S]  51.44 56.66 180 bottom
J4  25d9ce5fcc824b51a382671083746301  [TSW-101-07-G-S]  51.4 59.94 180 bottom
J5  db50c67101b641f09feebbd75da13b19  [TSW-108-07-G-S]  50.9 70.87 304 bottom
J6  25d9ce5fcc824b51a382671083746301  [TSW-101-07-G-S]  48.74 67.18 304 bottom
J7  25d9ce5fcc824b51a382671083746301  [TSW-101-07-G-S]  57.48 50.95 180 bottom
J8  25d9ce5fcc824b51a382671083746301  [TSW-101-07-G-S]  50.77 64.39 304 bottom
NOREF  -  [Pad_e71]  23.4 34.54 0 top
NOREF#2  -  [Pad_e37]  35.4 91.95 0 top
NOREF#3  -  [Pad_e70]  47.4 34.54 0 top
Q1  00e005c18c7a42d29c7f1ebcff9ec2f9  [SOT-23-3_L2.9-W1.3-P1.90-LS2.4-BR_LONG_PAD]  9.37 15.49 40 top
Q2  00e005c18c7a42d29c7f1ebcff9ec2f9  [SOT-23-3_L2.9-W1.3-P1.90-LS2.4-BR_LONG_PAD]  56.99 11.56 315 top
R1  10kΩ  [R1206]  24.48 4.83 249 top
R3  100Ω  [R1206]  49.24 6.35 116 top
R4  1kΩ  [R1206]  18.38 7.75 59 top
R5  1kΩ  [R1206]  12.67 12.32 227 top
R6  10kΩ  [R1206]  52.8 8.38 123 top
R7  22.1Ω  [R1206]  45.94 4.83 110 top
R8  3.32kΩ  [R1206]  21.43 6.1 244 top
SPK1  2.048kHz  [CEM-1203(42)]  35.33 81.18 180 bottom
U1  82908ec7757f43da87b5bf82fbb97953  [RPI_ZERO_2W_SMD]  35.27 22.86 0 bottom
U2  BME280-3V3 MODULE  [BME280-3V3]  35.02 2.67 90 bottom
U4  54269ddf84ef4b51b45058d1ac8f8b62  [DS3231_FOR_PI]  32.47 66.32 146.1 top
U5  e1bf4ba7ba59426bb17f7f0a6772dce8  [DRV2605L_MODULE]  39.94 54.75 0 bottom
U6  MT6701CT-AKD  [SOIC-8_MT6701_LONG_PAD]  35.53 34.54 0 top
U7  e600161ae6e94e2281b32d82396dab58  [VEML7700-TT]  35.4 76.2 0 top

## Footprints (pads in the part's own frame, mm; a bottom-side part is the same pattern mirrored in y, then rotated)
12BIT_WS2812_RING
  oval 1.778x3.318 hole 1x2.54 rot 45: 1(-17.897,12.508) 2(-16.101,14.305) 3(-14.305,16.101) 4(-12.508,17.897)
BME280-3V3
  rect 2.4x1.753 hole 1: 1(-4.25,6.35)
  oval 2.4x1.753 hole 1: 2(-4.25,3.81) 3(-4.25,1.27) 4(-4.25,-1.27) 5(-4.25,-3.81) 6(-4.25,-6.35)
C1206
  rect 1.485x1.728 smd: 1(-1.593,0) 2(1.593,0)
CEM-1203(42)
  rect 2x2 hole 1.2: 1(-3.25,0)
  round 2 hole 1.2: 2(3.25,0)
DRV2605L_MODULE
  rect 1.753x2.4 hole 1: 1(11.811,3.556)
  oval 1.753x2.4 hole 1: 2(14.351,3.556) 3(16.891,3.556) 4(19.431,3.556) 5(21.971,3.556)
DS3231_FOR_PI
  rect 2.4x1.753 hole 1: 1(0,0)
  oval 2.4x1.753 hole 1: 2(0,-2.54) 3(0,-5.08) 4(0,-7.62) 5(0,-10.16)
Pad_e37
  round 5.002 hole 2.7: 1(0,0)
Pad_e70
  round 5 hole 2.4: 1(0,0)
Pad_e71
  round 5 hole 2.4: 1(0,0)
R1206
  rect 1.208x1.701 smd: 1(-1.479,0) 2(1.479,0)
RPI_ZERO_2W_SMD
  rect 1.02x3.3 smd: 1(24.892,5.08) 2(24.892,9.78) 3(22.352,5.08) 4(22.352,9.78) 5(19.812,5.08) 6(19.812,9.78) 7(17.272,5.08) 8(17.272,9.78) 9(14.732,5.08) 10(14.732,9.78) 11(12.192,5.08) 12(12.192,9.78) 13(9.652,5.08) 14(9.652,9.78) 15(7.112,5.08) 16(7.112,9.78) 17(4.572,5.08) 18(4.572,9.78) 19(2.032,5.08) 20(2.032,9.78) 21(-0.508,5.08) 22(-0.508,9.78) 23(-3.048,5.08) 24(-3.048,9.78) 25(-5.588,5.08) 26(-5.588,9.78) 27(-8.128,5.08) 28(-8.128,9.78) 29(-10.668,5.08) 30(-10.668,9.78) 31(-13.208,5.08) 32(-13.208,9.78) 33(-15.748,5.08) 34(-15.748,9.78) 35(-18.288,5.08) 36(-18.288,9.78) 37(-20.828,5.08) 38(-20.828,9.78) 39(-23.368,5.08) 40(-23.368,9.78)
  round 5 hole 2.7: 41(-28.238,7.43) 42(29.762,7.43) 43(29.762,-15.57) 44(-28.238,-15.57)
SMA_L4.3-W2.6-LS5.2-RD
  rect 2x2 smd: 1(-2.2,0) 2(2.2,0)
SOIC-8_MT6701_LONG_PAD
  rect 0.762x2.54 smd: 1(-1.905,-2.66) 2(-0.635,-2.66) 3(0.635,-2.66) 4(1.905,-2.66) 5(1.905,2.66) 6(0.635,2.66) 7(-0.635,2.66) 8(-1.905,2.66)
SOT-23-3_L2.9-W1.3-P1.90-LS2.4-BR_LONG_PAD
  rect 1x1.905 smd: 1(-0.95,-1.353) 2(0.95,-1.353) 3(0,1.353)
TSW-101-07-G-S
  rect 1.762x1.762 hole 1: 1(0,0)
TSW-104-07-G-S
  rect 1.753x1.753 hole 1: 1(-8.89,0)
  round 1.753 hole 1: 2(-6.35,0) 3(-3.81,0) 4(-1.27,0)
TSW-108-07-G-S
  rect 1.753x1.753 hole 1: 1(-8.89,0)
  round 1.753 hole 1: 2(-6.35,0) 3(-3.81,0) 4(-1.27,0) 5(1.27,0) 6(3.81,0) 7(6.35,0) 8(8.89,0)
VEML7700-TT
  rect 0.7x1.6 smd: 1(-1.905,0) 2(-0.635,0) 3(0.635,0) 4(1.905,0)

## Nets
As in the schematic, except:
GND: C1.1 C2.1 C3.1 D1.2 D3.2 J5.8 J6.1 NOREF.1 NOREF#3.1 Q2.2 R6.1 U1.6 U1.9 U1.14 U1.20 U1.25 U1.30 U1.34 U1.39 U2.2 U4.1 U5.2 U6.4 U7.3

Pads without a net: D2 2; D3 1; NOREF#2 1; U1 8 10 15 16 17 18 21 26 27 28 29 31 33 35 36 37 38 41 42 43 44; U2 5 6; U4 2; U5 5; U6 3 5

## Via types
v1: diameter 0.61, hole 0.305, Top Layer to Bottom Layer, 38 vias

## Routing (per net, layer and track width the routed paths; a pad name or vN(x,y) marks a point on that pad's centre or on a via; arc(x,y) is an arc through that point)
3V3: length 227.9
  Top Layer w0.762: 37.02,7.82 37.02,6.44 C3.2 ; 37.02,7.82 37.02,11.02 38.7,12.7 44.8,12.7 48.23,16.13 57.12,16.13 59.55,18.56 60.99,18.56 ; 37.02,7.82 36.59,8.26 31.65,8.26 29.24,5.84 28.16,5.84 25.77,3.45 R1.2 22.63,4.77 20.78,4.77 ; 37.02,7.82 42.01,7.82 42.77,7.06 42.77,4.06 41.37,2.67 ; 39.19,70.26 39.21,70.28 39.21,74.17 40.1,75.06 40.1,78.49 38.65,79.94 38.65,81.28 ; 39.19,70.26 39.19,68.94 34.77,64.52 34.77,61.16 ; 39.19,70.26 35.69,70.26 35.69,72.86 34.77,73.79 U7.2 ; 39.19,70.26 45.05,64.39 J8.1 ; J8.1 50.77,63.24 54.71,59.3 54.71,57.66 55.11,57.25 55.11,56.03 54.71,55.63 54.71,52.07 54.32,51.69 54.32,50.48 ; J8.1 53.23,64.39 J5.7 ; 9.51,13.85 11.66,11.7 R5.2 12.05,11.24 15.04,8.26 17.89,8.26 18.72,7.42 18.86,7.42 20.92,5.36 20.92,5.08 ; 33.34,36.93 33.55,36.72 33.55,35.34 34.98,33.91 37.21,33.91 41.31,38.01 44.71,38.01 54.32,47.63 v1(54.32,48.64) 54.32,50.48 ; 33.34,36.93 U6.8 ; 33.34,36.93 32.23,35.81 32.23,33.28 U6.1 U6.2 ; 55.98,53.98 55.98,52.13 54.32,50.48 ; 60.99,18.56 60.99,18.35 61.61,17.73 61.61,16.94 ; 60.99,18.56 60.99,28.13 v1(60.04,29.08)
  Bottom Layer w0.762: v1(54.32,48.64) 53.99,48.31 53.99,33.39 59.4,27.98 ; 59.4,27.98 59.4,28.45 v1(60.04,29.08) ; 59.4,27.98 59.4,25.21
5V0: length 118.3
  Top Layer w0.762: 25.62,15.62 27.28,17.27 v1(55.59,17.27) 55.59,30.73 56.38,31.52 56.38,46.89 ; 25.62,15.62 19.15,9.14 R4.2 ; 25.62,15.62 17.49,23.75 17.49,34.42 16.07,35.84 13.93,35.84 D3.3 ; 56.38,46.89 57.63,48.13 59.28,48.13 61.44,50.29 C2.2 ; 56.38,46.89 56.38,49.86 J7.1
  Bottom Layer w0.762: 59.4,20.51 59.4,18.29 58.39,17.27 v1(55.59,17.27) 56.86,18.54 56.86,20.51
GND: length 89.4
  Top Layer w0.762: v1(36.86,73.98) 36.04,74.8 U7.3 ; v1(54.32,22.86) v1(49.24,22.86) ; v1(58.52,56.26) 58.52,53.98 59.53,52.96 60.1,52.96 C2.1 ; U6.4 v1(39.08,31.88) ; C1.1 32.55,6.35 34.33,4.57 36.66,4.57 36.78,4.45 37.18,4.45 38.83,2.79 38.83,2.67 39.82,3.66 39.82,5.11 40.42,5.72 ; v1(41.5,34.29) 47.15,34.29 NOREF#3.1 50.13,31.81 v1(50.13,29.34) ; v1(19.65,14.86) 17.35,12.56 D1.2 ; v1(46.32,12.06) 47.47,12.06 50.26,9.27 50.26,8.19 51.39,7.06 53.52,7.06 R6.1 53.92,7.14 56.71,9.93
  Bottom Layer w0.762: 18.76,20.51 18.76,15.75 v1(19.65,14.86) ; 44.16,20.51 44.16,14.22 v1(46.32,12.06) ; v1(49.24,22.86) 49.24,25.21 ; 37.4,61.05 37.4,64.23 38.7,65.53 38.7,72.14 v1(36.86,73.98)
$1N1876: length 86.8
  Top Layer w0.254: v1(45.94,16) 34.81,16 R1.1
  Bottom Layer w0.254: 46.93,69.87 46.93,69.36 45.95,68.38 45.36,68.38 45.18,68.2 45.18,66.42 49.63,61.98 49.63,55.25 50.95,53.92 50.95,32.08 52.04,30.99 52.04,25.46 51.78,25.21 51.78,24.13 50.77,23.11 50.77,18.29 48.48,16 v1(45.94,16)
$1N2735: length 191.6
  Top Layer w0.254: 32.6,77.98 36.93,77.98 37.31,77.6 U7.4 ; 32.6,77.98 30.96,77.98 29.31,76.33 29.31,76.07 31.67,73.71 31.67,68.15 ; 32.6,77.98 37.85,83.24 39.09,83.24 40.71,81.62 40.71,76.1 42.22,74.59 43.58,74.59 44.09,74.08 ; 31.67,68.15 26.64,63.12 26.64,60.07 28.16,58.55 43.15,58.55 v1(53.05,48.64) ; 31.67,68.15 34.28,68.15 ; v1(53.05,48.64) 47.6,48.64 42.89,43.94 42.89,40.51 41.25,38.87 36.93,38.87 36.91,38.86 36.89,38.86 36.16,38.12 U6.6 ; v1(53.05,48.64) 53.44,49.02 53.44,57.91 J4.1 48.86,59.94 47.97,59.06 44.49,59.06 42.39,61.16
  Bottom Layer w0.254: 33.75,2.67 34.11,2.67 38.81,7.37 44.29,7.37 55.59,18.67 55.59,23.94 56.99,25.34 v1(56.99,28.19) 52.8,32.39 52.8,48.39 v1(53.05,48.64)
$1N2755: length 186.4
  Top Layer w0.254: v1(56.05,56.72) 56.05,59.23 55.98,59.3 55.98,60.33 v1(54.45,61.85) ; v1(33.5,74.55) U7.1 ; 45.93,56.66 43.4,59.18 41.82,59.18 ; 45.93,56.66 J3.1 ; 45.93,56.66 46.7,55.88 v1(47.09,55.88) ; 42.67,76.18 43.93,76.18 v1(46.58,73.53) ; 41.82,59.18 33.37,59.18 33.12,59.44 33.12,65.79 32.86,66.04 ; 41.82,59.18 39.85,61.16 ; U6.7 34.89,38.22 34.25,38.86 29.43,38.86 28.26,40.03 28.26,41.42 30.28,43.43 34.64,43.43 v1(35.4,44.2)
  Bottom Layer w0.254: v1(54.45,61.85) 53.52,62.79 50.37,62.79 47.13,66.03 47.13,67.58 47.58,68.02 47.58,68.72 47.77,68.91 47.77,68.92 48.19,69.35 48.19,71.07 46.58,72.68 v1(46.58,73.53) ; v1(47.09,55.88) v1(35.4,44.2) ; 32.86,66.04 28.67,70.23 28.67,70.36 32.86,74.55 v1(33.5,74.55) ; v1(56.05,56.72) 51.81,56.72 51.56,56.46 51.56,32.36 54.32,29.59 54.32,25.21 53.88,25.21 52.93,24.26 52.93,17.32 43.33,7.72 38.55,7.72 35.08,4.25 32.92,4.25 32.48,3.81 32.48,1.78 33.24,1.02 34.64,1.02 36.29,2.67
$1N3138: length 58.9
  Top Layer w0.254: v1(49.37,40.01) v1(55.21,40.01)
  Bottom Layer w0.254: 50.19,71.92 50.35,71.76 50.35,67.24 56.74,60.85 56.74,56.43 55.21,54.91 v1(55.21,40.01) ; v1(49.37,40.01) 47.19,37.82 46.05,37.82 43.94,35.71 43.94,33.58 44.16,33.35 44.16,25.21
$1N3152: length 116.5
  Top Layer w0.254: v1(36.54,28.45) 34,28.45 27.4,35.05 27.4,41.65 25.93,43.13 25.93,73.83 28.59,76.5 28.59,76.62 31.35,79.38 32.74,79.38 37.31,83.95 39.39,83.95 41.29,82.04 v1(42.51,82.04) ; 51.61,69.81 50.76,70.66 49.66,70.66 47.51,72.82 47.51,73.91 44.55,76.87 44.55,77.22 44.37,77.4 44.24,77.4 v1(42.77,78.87)
  Bottom Layer w0.254: v1(42.77,78.87) 42.26,79.38 31.59,79.38 30.58,80.39 30.58,81.66 31.58,82.66 39.81,82.66 40.68,81.79 42.26,81.79 v1(42.51,82.04) ; 36.54,25.21 v1(36.54,28.45)
$1N3158: length 96.8
  Top Layer w0.254: v1(31.46,29.08) 26.38,34.16 26.38,40.77 24.71,42.45 24.71,76.05 33.5,84.84 42.5,84.84 48.61,78.73 48.61,76.5 50.51,74.59 50.51,74.17 51.78,72.9 51.78,71.88 53.31,70.36 53.31,67.99 J5.6
  Bottom Layer w0.254: 31.46,25.21 v1(31.46,29.08)
$1N3184: length 122.4
  Top Layer w0.254: 45.92,78.24 45.92,78.11 45.67,77.85 45.61,77.85 44.6,78.87 43.96,78.87 39.24,83.59 37.46,83.59 32.73,78.87 31.34,78.87 28.95,76.47 28.95,76.35 26.28,73.68 26.28,59.92 27.91,58.3 27.91,35.18 33.62,29.46 39.47,29.46 40.1,30.1 40.1,34.93 42.13,36.96 45.74,36.96 46.21,37.43 48.59,37.43 48.62,37.4 49.56,37.4 v1(50.26,36.7)
  Bottom Layer w0.254: 46.7,20.51 46.83,20.38 46.83,18.29 47.59,17.53 49.37,17.53 50.28,18.44 50.28,23.13 50.67,23.52 50.67,26.52 50.89,26.75 50.89,27.02 51.4,27.53 51.4,30.61 50.28,31.73 50.28,36.68 v1(50.26,36.7)
$1N3198: length 89.1
  Top Layer w0.254: v1(32.61,22.86) 32.73,22.99 32.73,28.78 26.89,34.63 26.89,41.28 25.37,42.8 25.37,73.9 31.27,79.8 32.66,79.8 37.19,84.33 42.39,84.33 47.97,78.74 47.97,76.76 J5.2
  Bottom Layer w0.254: v1(32.61,22.86) 32.61,21.65 31.46,20.51
$1N3220: length 85.3
  Bottom Layer w0.254: 34,20.51 34,18.42 34.64,17.78 37.66,17.78 37.84,17.96 37.84,22.73 38.09,22.99 40.23,22.99 40.48,23.24 40.48,26.77 43.53,29.81 43.53,35.81 49.75,42.04 49.75,53.48 48.56,54.68 48.56,61.41 42.46,67.5 42.46,73.73 41.07,75.11 41.07,76.58 42.27,77.78 43.06,77.78 44.27,76.58 44.27,76.43 45.83,74.87 47.87,74.87 48.15,75.15 48.4,75.15 48.97,74.59 48.97,74.23 J5.3
$1N3578: length 110.5
  Top Layer w0.254: v1(47.97,9.4) 47.97,8.3 R3.2
  Top Layer w0.762: v1(56.86,14.48) 58.15,14.48 D2.1
  Bottom Layer w0.254: 32.15,81.28 33.68,79.76 45.45,79.76 45.53,79.83 46.32,79.83 49.06,77.09 50.04,77.09 50.21,76.92 63.15,56.3 68.68,43.73 68.68,25.57 66.61,20.16 63.88,15.41 62.95,14.48 v1(56.86,14.48) 53.05,14.48 v1(47.97,9.4)
$1N4140: length 11
  Top Layer w0.254: R5.1 13.68,15.63 v1(11.78,17.53) 10.96,16.71 Q1.2
  Bottom Layer w0.254: v1(11.78,17.53) 11.14,18.16 11.14,20.51
$1N4146: length 45.8
  Top Layer w0.254: R4.1 18.13,6.48 v1(19.02,5.59) ; D3.4 11.14,38.35 9.37,36.58 9.37,17.4 Q1.3 8.5,16.28 v1(7.59,15.37)
  Bottom Layer w0.254: v1(19.02,5.59) 19.02,7.11 19.15,7.24 19.15,7.49 11.27,15.37 v1(7.59,15.37)
$1N4451: length 12.9
  Top Layer w0.254: R3.1 50.15,5.28 52.64,5.28 55.2,6.84 55.47,7.11 55.47,7.59 56.4,8.52 56.54,8.52 58.11,10.09 58.11,12.35 Q2.3
$1N4603: length 31.9
  Top Layer w0.254: v1(44.29,9.65) 45.44,8.51 R7.2
  Bottom Layer w0.254: v1(44.29,9.65) 40.61,9.65 38.7,11.56 29.48,11.56 26.08,14.96 26.08,15.1 22.7,18.48 22.7,19.11 21.3,20.51
$1N4609: length 15
  Top Layer w0.254: v1(52.8,8.38) 52.8,8.82 R6.2 53.65,11.27 Q2.1 ; v1(46.7,5.33) 46.45,5.08 46.45,3.44
  Bottom Layer w0.254: v1(46.7,5.33) 49.75,5.33 v1(52.8,8.38)
$1N5451: length 93.8
  Top Layer w0.254: 22.08,7.43 22.08,10.55 v1(26.77,15.24)
  Bottom Layer w0.254: 45.51,71.97 44.82,71.29 44.82,66.27 49.27,61.83 49.27,55.1 50.39,53.98 50.39,38.35 49.5,37.47 46.2,37.47 44.29,35.56 44.29,33.72 44.52,33.5 44.52,33.35 46.7,31.17 46.7,24.94 44.5,22.73 41.15,22.73 40.48,22.07 40.48,15.37 39.08,13.97 28.35,13.97 27.08,15.24 v1(26.77,15.24)

## Copper pours and planes (outline as drawn; the poured copper is in the pictures)
GND on Bottom Layer: 46.68,82.9 43.28,87.81 40.35,92.17 38.13,95.78 37.35,97.24 36.84,98.44 36.61,98.86 36.27,99.19 35.85,99.4 35.38,99.48 34.92,99.4 34.49,99.2 34.14,98.89 33.89,98.47 33.38,97.34 32.63,95.96 30.5,92.53 27.71,88.39 24.48,83.73 20.46,77.94 16.29,71.77 12.19,65.39 10.23,62.17 8.36,58.94 6.62,55.73 5.02,52.56 3.6,49.45 2.37,46.41 1.37,43.46 0.63,40.63 0.16,37.92 0.04,36.62 0,35.36 0.05,33.54 0.18,31.75 0.41,29.98 0.72,28.24 1.11,26.53 1.59,24.86 2.15,23.22 2.78,21.61 3.49,20.04 4.27,18.52 5.13,17.04 6.05,15.6 7.03,14.22 8.08,12.88 9.2,11.6 10.37,10.37 11.6,9.2 12.88,8.09 14.22,7.03 15.6,6.05 17.04,5.13 18.52,4.27 20.04,3.49 21.61,2.78 23.21,2.15 24.86,1.59 26.53,1.12 28.24,0.72 29.98,0.41 31.75,0.18 33.54,0.05 35.36,0 37.18,0.05 38.97,0.18 40.74,0.41 42.48,0.72 44.19,1.12 45.86,1.59 47.5,2.15 49.11,2.78 50.68,3.49 52.2,4.27 53.68,5.13 55.12,6.05 56.5,7.03 57.84,8.09 59.12,9.2 60.35,10.37 61.52,11.6 62.63,12.88 63.69,14.22 64.67,15.6 65.59,17.04 66.44,18.52 67.23,20.04 67.94,21.61 68.57,23.22 69.13,24.86 69.6,26.53 70,28.24 70.31,29.98 70.54,31.75 70.67,33.54 70.72,35.36 70.68,36.6 70.56,37.88 70.1,40.54 69.37,43.33 68.39,46.23 67.19,49.21 65.79,52.27 64.22,55.39 62.5,58.54 60.67,61.71 58.75,64.88 54.72,71.15 50.63,77.21

Small or netless copper shapes (teardrops, artwork), in the pictures only: 110 on Top Layer, 62 on Bottom Layer

## Text on the board
Document Layer: Layer | Top Silkscreen Layer | Top Paste Mask Layer | Top Solder Mask Layer | Top Layer | Dielectric1 | Bottom Layer | Bottom Solder Mask Layer | Bottom Paste Mask Layer | Bottom Silkscreen Layer | Type | TOP_SILK | TOP_PASTE_MASK | TOP_SOLDER_MASK | TOP | SUBSTRATE | BOTTOM | BOT_SOLDER_MASK | BOT_PASTE_MASK | BOT_SILK | Material | - | FR4 | Thickness(mm) | 0 | 0.01 | 0.035 | 1.51 | Permittivity | 3.3 | 4.5 | Loss Tangent | 0.02 | FABRICATION NOTES : / SOLDER MASK : BLACK / PCB THICKNESS : 1.6MM / NUMBER OF LAYERS : 2 / FINISH : LEAD FREE HASL / COPPER WEIGHT : 1 0Z / MATERIAL: FR4 / STENCIL : NO / CLEARANCE MIN = 10MILS / TRACK WIDTH MIN = 10MILS / RELEASED UNDER THE CREATIVE COMMONS ATTRIBUTION SHARE-ALIKE 4.0 LICENSE / https://creativecommons.org/licenses/by-sa/4.0/
Top Silkscreen Layer: HAPTGP 1V0 / EDDIE PELLETIER
Drill Drawing Layer: Mark | Count | 2 | 4 | 5 | 29 | 33 | Size | 94.5x94.5mil(2.400x2.400mm) | 47.2x47.2mil(1.200x1.200mm) | 39.4x100.0mil(1.000x2.540mm) | 106.3x106.3mil(2.700x2.700mm) | 12.0mil(0.305mm) | 39.4x39.4mil(1.000x1.000mm) | Plated | PTH | Shape | Round | Slot | Via/Pad | Pad | Via | Pad Shape | (Mixed) | Oval | Layer Pair | Top Layer-Bottom Layer
